# Altium schematic sheet power.SchDoc
size A; SheetNumber: 2; SheetTotal: 3
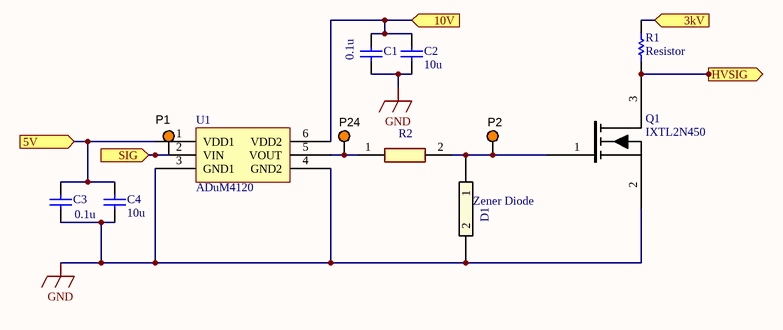
[diagram p0: power.SchDoc]

## Parts
C1  Capacitor  [0.1uF Cer SMD]  (value not drawn)
C2  10u  [10uF Cer SMD]
C3  Capacitor  [0.1uF Cer SMD]  (value not drawn)
C4  10u  [10uF Cer SMD]
D1  Zener Diode  [Zener Diode]
P1  5003  [KSTN-5003]  (value not drawn)
P2  5003  [KSTN-5003]  (value not drawn)
P24  5003  [KSTN-5003]  (value not drawn)
Q1  IXTL2N450  [MOSFET]
R1  Resistor  [10M Ohm]
R2  PWR3014W5R00JE  [RESM7535X515N]  (value not drawn)
U1  ADuM4120  [Gate Driver]

## Ports
3kV (in), 5V (in), 10V (in), HVSIG (out), SIG (in)

## Nets
GND: C1.1 C2.1 C3.1 C4.1 D1.2 Q1.2(S) U1.3(GND1) U1.4(GND2)
3kV: R1.1 ; port 3kV
5V: C3.2 C4.2 U1.1(VDD1) ; port 5V
10V: C1.2 C2.2 U1.6(VDD2) ; port 10V
HVSIG: Q1.3(D) R1.2 ; port HVSIG
SIG: P1.1 U1.2(VIN) ; port SIG
NetD1_1: D1.1 P2.1 Q1.1(G) R2.2
NetP24_1: P24.1 R2.1 U1.5(VOUT)

## Notes on the sheet
- (near C1) 0.1u
- 0.1u

## Library data of the parts
C2 C4 = Capacitor
D1 = Zener Diode: KDZVTR16B; Vendor: ROHM Semiconductor; Built_By: EMA_Matt; SourceLibrary: Rohm_2019-09-23; Type: DEV; Manufacturer_Part_Number: KDZVTR16B; Copyright: Copyright (C) 2018 Accelerated Designs. All rights reserved; RefDes: RefDes
P1 P2 P24 = CMP-002-00037-2: Test Point, Orange, Height 4.6 mm, Tail Length 3 mm, 1-Pin THD, RoHS; Manufacturer: Keystone; Colour: Orange; Packaging: Bulk; Package Description: 1-Pin Through Hole Device, Dia 2.54 mm; Pins: 1; Package Reference: 5003; Datasheet Version: Jun-15; Case/Package: 5003; Mounting Technology: TH; Connector Type: TestPoint; Diameter: 2.54mm; Contact Material: Bronze; Datasheet URL: http://keyelco.com/userAssets/file/M65p56.pdf; Manufacturer URL: http://www.keyelco.com/; Package Quantity: 10; Contact Plating: Tin; RoHS Compliant: True
Q1 = MOSFET: IXTL2N4X0
R2 = PWR3014W5R00JE: Resistor; Manufacturer_Name: Bourns; Datasheet Link: https://componentsearchengine.com/Datasheets/2/PWR3014W5R00JE.pdf; Height: 5.148mm; Manufacturer_Part_Number: PWR3014W5R00JE
U1 = Gate Driver